# EasyEDA Pro project ProPrj_Hitboard PCB Zero v1.6_2026-01-22 中央 typec.epro

# Board PCB1
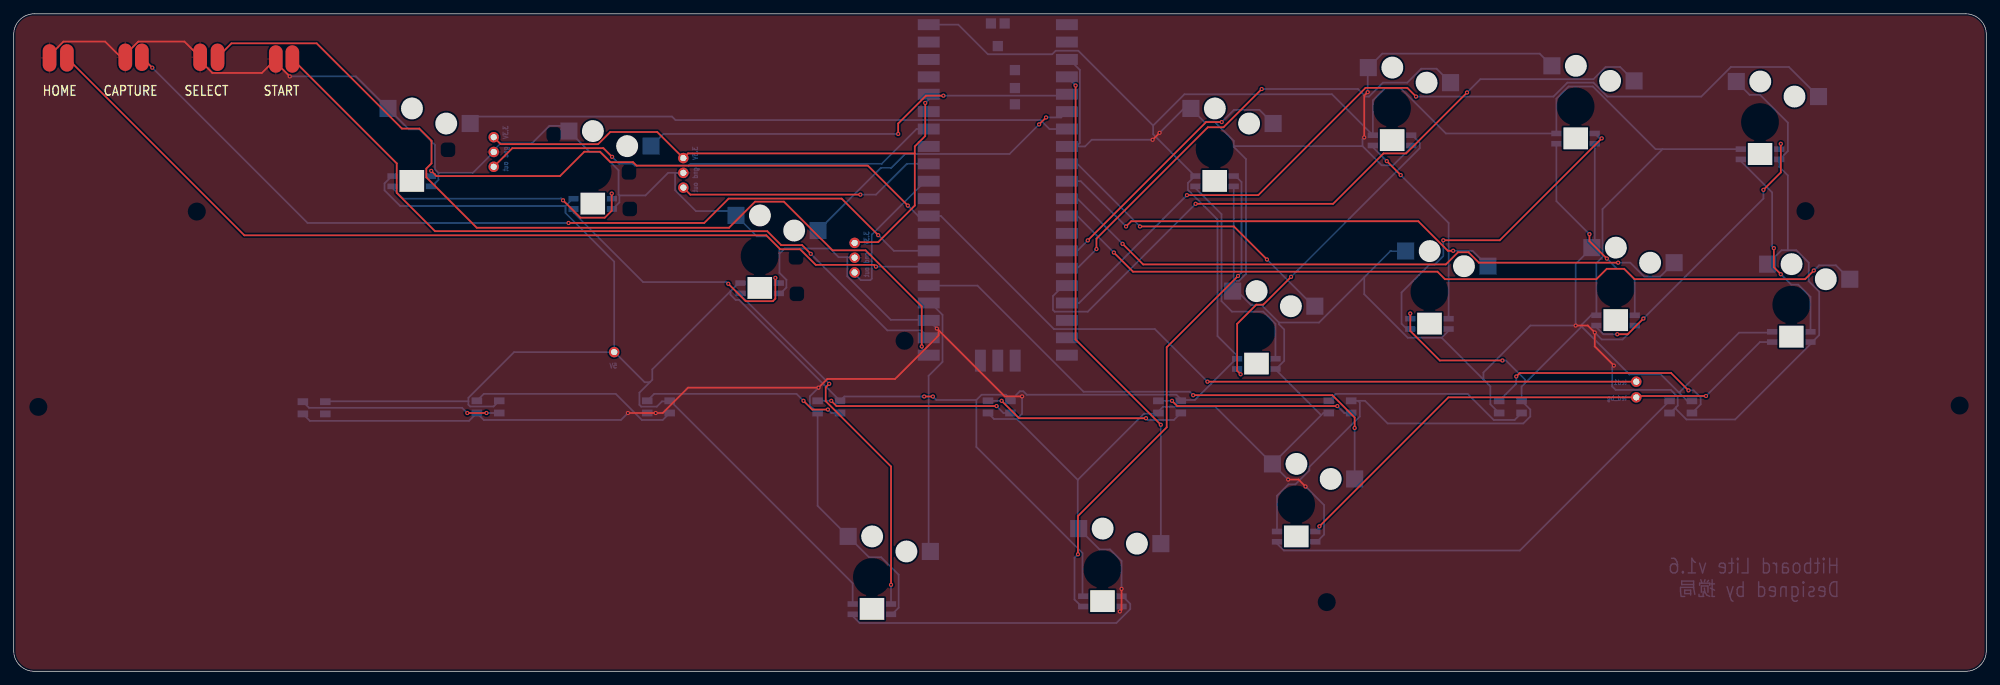
[diagram p0: board, top side]
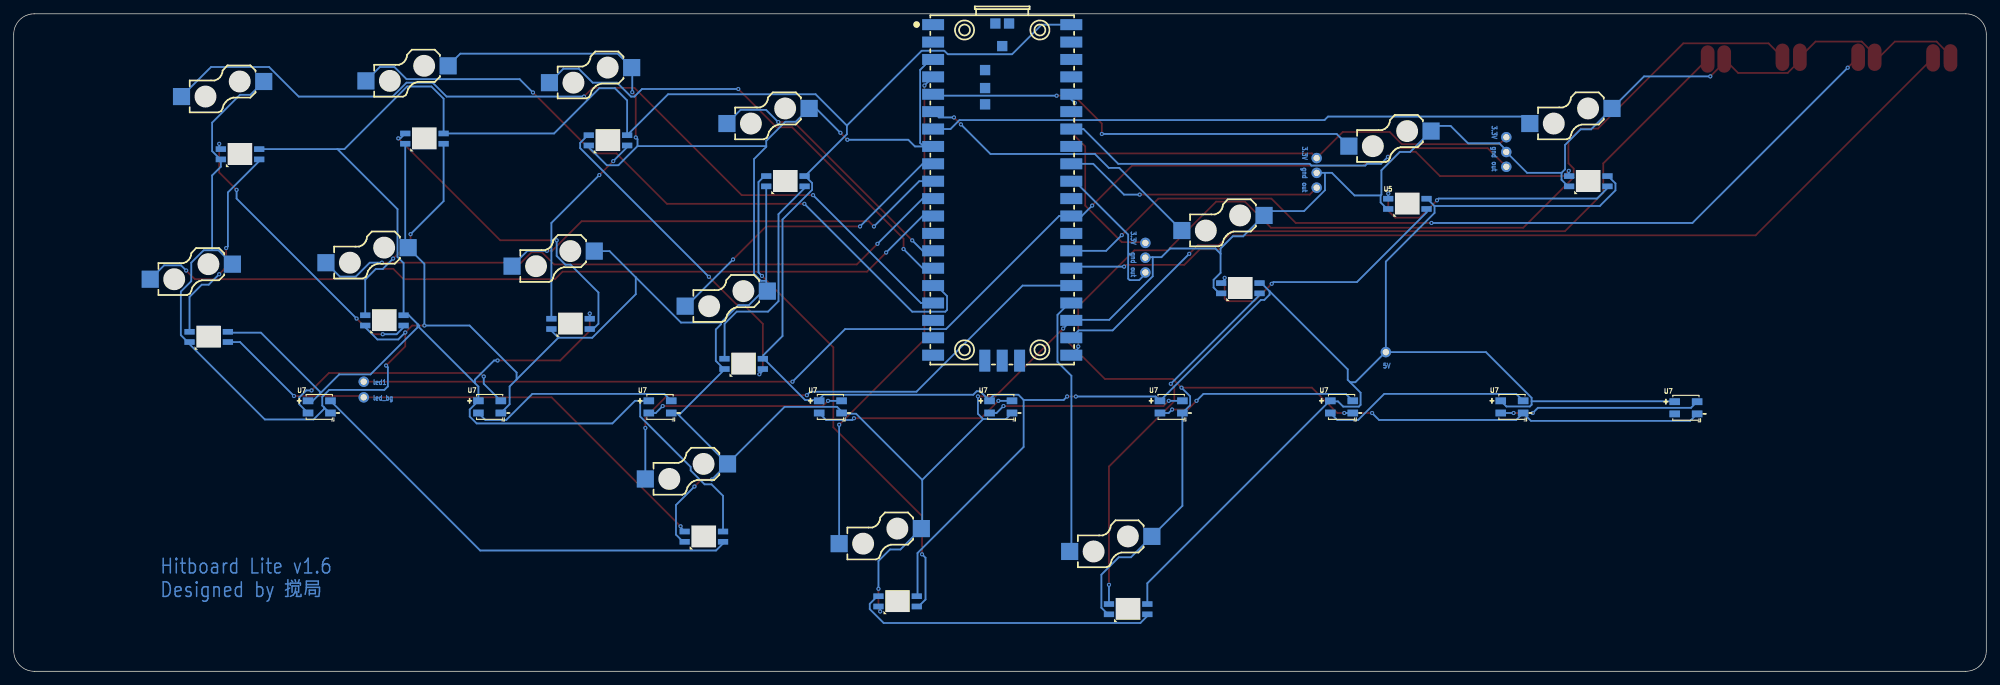
[diagram p1: board, bottom side, seen from below]

Outline 288 x 96 mm; copper layers: Top Layer, Bottom Layer. Coordinates in mm from the lower left corner of the outline.
Outline path: 0,93 arc(0.88,95.12) 3,96 285,96 arc(287.12,95.12) 288,93 288,3 arc(287.12,0.88) 285,0 3,0 arc(0.88,0.88) 0,3 0,93
Stack: Top Layer 0.035mm / Dielectric1 1.51mm FR4 er 4.5 / Bottom Layer 0.035mm

## Design rules (mm)
template: JLCPCB Capability(Two Layers Board)
spacing copperThickness1oz (default): track to track 0.102, other pairs 0.152 to 0.3
spacing copperThickness2oz: track to track 0.203, other pairs 0.152 to 0.3
track width copperThickness1oz (default): min 0.127, default 0.254, max 2.54
track width copperThickness2oz: min 0.203, default 0.254, max 2.54
differential pair differentialPair (default): width min 0.127, default 0.254, max 2.54; gap min 0.152, default 0.152
via viaSize (default): diameter min 0.5, default 0.61, max 10; hole min 0.3, default 0.305, max 6.3

## Placement (name value [footprint] x y rotation side)
NOREF  -  [Pad_e675]  5.23 89.56 0 top
NOREF#2  -  [Pad_e10656]  122.78 62.55 90 top
NOREF#3  -  [Pad_e677]  16.3 89.66 0 top
NOREF#4  -  [Pad_e10672]  70.08 73.66 90 top
NOREF#5  -  [Pad_e10654]  87.67 46.6 0 top
NOREF#6  -  [Pad_e10671]  70.08 75.82 90 top
NOREF#7  -  [Pad_e10657]  122.78 60.39 90 top
NOREF#8  -  [Pad_e681]  38.27 89.4 0 top
NOREF#9  -  [Pad_e678]  18.71 89.66 0 top
NOREF#10  -  [Pad_e679]  27.22 89.66 0 top
NOREF#11  -  [Pad_e676]  7.77 89.56 0 top
NOREF#12  -  [Pad_e10665]  97.77 72.78 90 top
NOREF#13  -  [Pad_e10670]  70.08 77.98 90 top
NOREF#14  -  [Pad_e680]  29.76 89.66 0 top
NOREF#15  -  [Pad_e10658]  122.78 58.23 90 top
NOREF#16  -  [Pad_e682]  40.68 89.4 0 top
NOREF#17  -  [Pad_e10664]  97.77 74.93 90 top
NOREF#18  -  [Pad_e5255]  236.9 40 0 top
NOREF#19  -  [Pad_e10666]  97.77 70.62 90 top
NOREF#20  -  [Pad_e434]  236.9 42.29 0 top
U1  PICO  [COMM-SMD_L51.0-W21.0-P2.54_SC0916]  143.68 69.97 270 bottom
U5  -  [LED-SMD_L3.2-W2.8_YO-WS2812B-3528]  187.24 19.66 180 bottom
U5#2  -  [LED-SMD_L3.2-W2.8_YO-WS2812B-3528]  58.11 71.56 180 bottom
U5#3  -  [LED-SMD_L3.2-W2.8_YO-WS2812B-3528]  84.52 68.25 180 bottom
U5#4  -  [LED-SMD_L3.2-W2.8_YO-WS2812B-3528]  108.91 55.93 180 bottom
U5#5  -  [LED-SMD_L3.2-W2.8_YO-WS2812B-3528]  125.29 9.07 180 bottom
U5#6  -  [LED-SMD_L3.2-W2.8_YO-WS2812B-3528]  158.95 10.21 180 bottom
U5#7  -  [LED-SMD_L3.2-W2.8_YO-WS2812B-3528]  175.33 71.56 180 bottom
U5#8  -  [LED-SMD_L3.2-W2.8_YO-WS2812B-3528]  181.43 44.89 180 bottom
U5#9  -  [LED-SMD_L3.2-W2.8_YO-WS2812B-3528]  201.24 77.52 180 bottom
U5#10  -  [LED-SMD_L3.2-W2.8_YO-WS2812B-3528]  206.7 50.73 180 bottom
U5#11  -  [LED-SMD_L3.2-W2.8_YO-WS2812B-3528]  228.03 77.78 180 bottom
U5#12  -  [LED-SMD_L3.2-W2.8_YO-WS2812B-3528]  233.88 51.24 180 bottom
U5#13  -  [LED-SMD_L3.2-W2.8_YO-WS2812B-3528]  254.96 75.49 180 bottom
U5#14  -  [LED-SMD_L3.2-W2.8_YO-WS2812B-3528]  259.53 48.82 180 bottom
U6  -  [CONN-SMD_HOTPLUGPAKAGE__C9900010116-1]  203.78 87.05 180 bottom
U6#2  -  [CONN-SMD_HOTPLUGPAKAGE__C9900010116-1]  189.78 29.18 180 bottom
U6#3  -  [CONN-SMD_HOTPLUGPAKAGE__C9900010116-1]  60.65 81.08 180 bottom
U6#4  -  [CONN-SMD_HOTPLUGPAKAGE__C9900010116-1]  87.06 77.78 180 bottom
U6#5  -  [CONN-SMD_HOTPLUGPAKAGE__C9900010116-1]  111.45 65.46 180 bottom
U6#6  -  [CONN-SMD_HOTPLUGPAKAGE__C9900010116-1]  127.83 18.6 180 bottom
U6#7  -  [CONN-SMD_HOTPLUGPAKAGE__C9900010116-1]  161.49 19.74 180 bottom
U6#8  -  [CONN-SMD_HOTPLUGPAKAGE__C9900010116-1]  177.87 81.08 180 bottom
U6#9  -  [CONN-SMD_HOTPLUGPAKAGE__C9900010116-1]  183.97 54.41 180 bottom
U6#10  -  [CONN-SMD_HOTPLUGPAKAGE__C9900010116-1]  209.24 60.25 180 bottom
U6#11  -  [CONN-SMD_HOTPLUGPAKAGE__C9900010116-1]  230.57 87.3 180 bottom
U6#12  -  [CONN-SMD_HOTPLUGPAKAGE__C9900010116-1]  236.42 60.76 180 bottom
U6#13  -  [CONN-SMD_HOTPLUGPAKAGE__C9900010116-1]  257.5 85.02 180 bottom
U6#14  -  [CONN-SMD_HOTPLUGPAKAGE__C9900010116-1]  262.07 58.35 180 bottom
U7  -  [LED-SMD_4P-L3.5-W3.5-TL_WS2812B]  43.86 38.48 180 bottom
U7#2  -  [LED-SMD_4P-L3.5-W3.5-TL_WS2812B]  243.39 38.6 180 bottom
U7#3  -  [LED-SMD_4P-L3.5-W3.5-TL_WS2812B]  218.51 38.6 180 bottom
U7#4  -  [LED-SMD_4P-L3.5-W3.5-TL_WS2812B]  193.64 38.6 180 bottom
U7#5  -  [LED-SMD_4P-L3.5-W3.5-TL_WS2812B]  168.76 38.6 180 bottom
U7#6  -  [LED-SMD_4P-L3.5-W3.5-TL_WS2812B]  143.88 38.6 180 bottom
U7#7  -  [LED-SMD_4P-L3.5-W3.5-TL_WS2812B]  119.01 38.6 180 bottom
U7#8  -  [LED-SMD_4P-L3.5-W3.5-TL_WS2812B]  94.13 38.6 180 bottom
U7#9  -  [LED-SMD_4P-L3.5-W3.5-TL_WS2812B]  69.26 38.6 180 bottom

## Footprints (pads in the part's own frame, mm; a bottom-side part is the same pattern mirrored in y, then rotated)
COMM-SMD_L51.0-W21.0-P2.54_SC0916
  rect 1.6x3.2 smd: 1(-24.445,-10.088) 2(-21.905,-10.088) 3(-19.365,-10.088) 4(-16.825,-10.088) 5(-14.285,-10.088) 6(-11.745,-10.088) 7(-9.205,-10.088) 8(-6.665,-10.088) 9(-4.125,-10.088) 10(-1.585,-10.088) 11(0.955,-10.088) 12(3.495,-10.088) 13(6.035,-10.088) 14(8.575,-10.088) 15(11.115,-10.088) 16(13.655,-10.088) 17(16.195,-10.088) 18(18.735,-10.088) 19(21.275,-10.088) 20(23.815,-10.088) 21(23.815,10.088) 22(21.275,10.088) 23(18.735,10.088) 24(16.195,10.088) 25(13.655,10.088) 26(11.115,10.088) 27(8.575,10.088) 28(6.035,10.088) 29(3.495,10.088) 30(0.955,10.088) 31(-1.585,10.088) 32(-4.125,10.088) 33(-6.665,10.088) 34(-9.205,10.088) 35(-11.745,10.088) 36(-14.285,10.088) 37(-16.825,10.088) 38(-19.365,10.088) 39(-21.905,10.088) 40(-24.445,10.088)
  rect 3.2x1.6 smd: 41(24.615,-2.54) 42(24.615,0) 43(24.615,2.54)
  rect 1.5x1.5 smd: TP1(-21.315,0) TP2(-24.615,1) TP3(-24.615,-1) TP4(-17.815,-2.5) TP5(-15.188,-2.5) TP6(-12.815,-2.5)
CONN-SMD_HOTPLUGPAKAGE__C9900010116-1
  rect 2.5x2.5 smd: 1(-6,-1.1) 2(6,1.1)
LED-SMD_4P-L3.5-W3.5-TL_WS2812B
  rect 1.545x0.997 smd: 1(-1.637,0.89) 2(-1.637,-0.89) 3(1.637,-0.89) 4(1.637,0.89)
LED-SMD_L3.2-W2.8_YO-WS2812B-3528
  rect 1.5x0.82 smd: 1(2.8,0.75) 2(2.8,-0.75) 3(-2.8,-0.75) 4(-2.8,0.75)
Pad_e434
  round 1.524 hole 0.914: 1(0,0)
Pad_e675
  oval 2x4 smd: 1(0,0)
Pad_e676
  oval 2x4 smd: 1(0,0)
Pad_e677
  oval 2x4 smd: 1(0,0)
Pad_e678
  oval 2x4 smd: 1(0,0)
Pad_e679
  oval 2x4 smd: 1(0,0)
Pad_e680
  oval 2x4 smd: 1(0,0)
Pad_e681
  oval 2x4 smd: 1(0,0)
Pad_e682
  oval 2x4 smd: 1(0,0)
Pad_e5255
  round 1.524 hole 0.914: 1(0,0)
Pad_e10654
  round 1.524 hole 0.914: 1(0,0)
Pad_e10656
  round 1.524 hole 0.914: 1(0,0)
Pad_e10657
  round 1.524 hole 0.914: 1(0,0)
Pad_e10658
  round 1.524 hole 0.914: 1(0,0)
Pad_e10664
  round 1.524 hole 0.914: 1(0,0)
Pad_e10665
  round 1.524 hole 0.914: 1(0,0)
Pad_e10666
  round 1.524 hole 0.914: 1(0,0)
Pad_e10670
  round 1.524 hole 0.914: 1(0,0)
Pad_e10671
  round 1.524 hole 0.914: 1(0,0)
Pad_e10672
  round 1.524 hole 0.914: 1(0,0)

## Nets
3V3: NOREF#2.1 NOREF#13.1 NOREF#17.1 U1.36
GND: NOREF.1 NOREF#3.1 NOREF#6.1 NOREF#7.1 NOREF#8.1 NOREF#10.1 NOREF#12.1 U1.3 U1.8 U1.23 U5.3 U5#2.3 U5#3.3 U5#4.3 U5#5.3 U5#6.3 U5#7.3 U5#8.3 U5#9.3 U5#10.3 U5#11.3 U5#12.3 U5#13.3 U5#14.3 U6.2 U6#2.2 U6#3.2 U6#4.2 U6#5.2 U6#6.2 U6#7.2 U6#8.2 U6#9.2 U6#10.2 U6#11.2 U6#12.2 U6#13.2 U6#14.2 U7.3 U7#2.3 U7#3.3 U7#4.3 U7#5.3 U7#6.3 U7#7.3 U7#8.3 U7#9.3
VCC: NOREF#5.1 U1.40 U5.1 U5#2.1 U5#3.1 U5#4.1 U5#5.1 U5#6.1 U5#7.1 U5#8.1 U5#9.1 U5#10.1 U5#11.1 U5#12.1 U5#13.1 U5#14.1 U7.1 U7#2.1 U7#3.1 U7#4.1 U7#5.1 U7#6.1 U7#7.1 U7#8.1 U7#9.1
2: U5#2.2 U5#3.4
3: U5#3.2 U5#4.4
4: U5#4.2 U5#5.4
5: U5#5.2 U5#6.4
6: U5#6.2 U5#7.4
7: U5#7.2 U5#8.4
8: U5#8.2 U5#9.4
9: U5#9.2 U5#10.4
10: U5#10.2 U5#11.4
11: U5#11.2 U5#12.4
12: U5#12.2 U5#13.4
13: U5#13.2 U5#14.4
14: NOREF#18.1 U5.4 U5#14.2
15: U5.2 U7#2.4
16: U7#2.2 U7#3.4
17: U7#3.2 U7#4.4
18: U7#4.2 U7#5.4
19: U7#5.2 U7#6.4
20: U7#6.2 U7#7.4
21: U7#7.2 U7#8.4
22: U7#8.2 U7#9.4
23: U7.4 U7#9.2
24: U7.2
A: U1.9 U6#9.1
B: U1.10 U6#10.1
CAPTURE: NOREF#9.1 U1.27
CIZHOU01: NOREF#4.1 U1.34
CIZHOU02: NOREF#19.1 U1.32
CIZHOU03: NOREF#15.1 U1.31
DOWN: U1.5 U6#4.1
HOME: NOREF#11.1 U1.26
L3: U1.24 U6#6.1
LB: U1.17 U6#13.1
LED1: NOREF#20.1 U1.29 U5#2.4
LEFT: U1.7 U6#3.1
LT: U1.12 U6#14.1
R3: U1.25 U6#2.1
RB: U1.16 U6#11.1
RIGHT: U1.6 U6#5.1
RT: U1.11 U6#12.1
SELECT: NOREF#14.1 U1.21
START: NOREF#16.1 U1.22
UP: U1.4 U6#7.1
X: U1.14 U6#8.1
Y: U1.15 U6.1

Pads without a net: U1 1 2 13 18 19 20 28 30 33 35 37 38 39 41 42 43 TP1 TP2 TP3 TP4 TP5 TP6

## Via types
v1: diameter 0.61, hole 0.305, Top Layer to Bottom Layer, 93 vias

## Routing (per net, layer and track width the routed paths; a pad name or vN(x,y) marks a point on that pad's centre or on a via; arc(x,y) is an arc through that point)
3V3: length 92.6
  Top Layer w0.254: 131.56,75.62 98.45,75.62 NOREF#17.1 93.96,78.74 87.1,78.74 85.32,76.97 71.1,76.97 NOREF#13.1 ; 131.56,75.62 131.56,68 126.22,62.67 122.89,62.67 NOREF#2.1 ; 131.56,75.62 131.56,76.64 133.08,78.16 v1(133.08,82.99)
  Bottom Layer w0.254: U1.36 133.59,83.49 v1(133.08,82.99)
GND: length 833.9
  Top Layer w0.254: 16.15,89.66 16.15,89.91 18.19,91.94 24.93,91.94 NOREF#10.1 27.22,89.15 29,87.37 36.24,87.37 NOREF#8.1 38.27,88.89 v1(40.3,86.86) ; 16.15,89.66 15.64,89.66 13.36,91.94 7.26,91.94 5.23,89.91 NOREF.1 ; 16.15,89.66 NOREF#3.1 ; v1(89.68,37.71) v1(93.74,37.71) 94.76,37.71 98.46,41.41 v1(117.51,41.41) 118.78,42.68 128.68,42.68 135.03,49.03 135.03,49.8 ; 135.03,49.8 v1(134.78,50.05) ; 135.03,49.8 144.68,40.14 v1(147.22,40.14) ; v1(233.63,44.64) 230.83,47.44 v1(230.83,49.47) 229.82,50.49 v1(228.04,50.49) ; v1(188.61,26.98) 187.59,28 v1(186.07,28) ; v1(161.49,8.74) 161.75,8.99 v1(161.75,12.04) ; v1(197.18,77.95) 197.18,84.05 v1(197.69,84.56) ; v1(167.3,78.62) v1(166.28,77.61)
  Bottom Layer w0.254: 62.01,72.78 62.01,71.77 61.05,70.81 U5#2.3 ; 62.01,72.78 61.51,73.29 61.51,76.85 59.22,79.13 57.7,79.13 U6#3.2 49.97,86.86 v1(40.3,86.86) ; 62.01,72.78 67.04,72.78 NOREF#6.1 70.08,76.08 71.1,77.09 75.67,77.09 78.21,79.63 80.31,79.63 U6#4.2 84.11,75.83 85.64,75.83 88.31,73.15 88.31,69.6 88.43,69.48 ; 96.56,72.78 96.56,70.24 99.61,67.19 104.81,67.19 U6#5.2 108.5,63.51 110.02,63.51 111.8,61.73 111.8,60.97 ; 96.56,72.78 95.54,72.78 92.24,69.48 88.43,69.48 ; 96.56,72.78 97.76,72.78 ; U6#11.2 222.8,90.18 199.81,90.18 U6.2 197.69,88.06 v1(197.69,84.56) ; U5#6.3 161.49,9.21 v1(161.49,8.74) ; 155.35,27.95 165,37.6 166.78,37.6 ; 155.35,27.95 146.46,36.84 ; 155.35,27.95 155.35,20.97 U6#7.2 158.53,17.79 160.06,17.79 161.75,16.1 v1(161.75,12.04) ; 208.48,48.71 203.53,48.71 197.18,55.06 197.18,57.52 ; 208.48,48.71 209.5,49.72 U5#10.3 ; 208.48,48.71 214.58,42.61 ; U5#11.3 230.83,62.28 U6#12.2 228.04,59.48 v1(228.04,50.49) 221.44,50.49 214.58,43.63 214.58,42.61 ; U5#9.3 204.04,76.52 201.41,73.89 199.72,73.89 196.93,76.68 ; 259.03,61.48 259.03,72.4 257.76,73.67 257.76,74.69 ; 259.03,61.48 260.26,61.48 262.08,59.66 262.08,56.96 263.6,55.44 263.6,49.09 262.58,48.07 U5#14.3 262.33,47.77 251.33,36.77 244.22,36.77 242.69,38.29 242.69,38.55 ; 259.03,61.48 258.1,61.48 256.07,59.45 ; 183.78,30.28 190.89,37.4 ; 183.78,30.28 175.44,38.62 167.8,38.62 166.78,37.6 ; 183.78,30.28 v1(186.07,28) ; 190.89,37.4 191.21,37.71 U7#4.3 ; 190.89,37.4 184.22,44.06 ; v1(230.83,49.47) 231.85,48.45 234.9,48.45 236.68,50.23 U5#12.3 ; 178.13,76.68 178.13,76.57 179.91,74.8 179.91,58.03 178.89,57.02 178.13,57.02 ; 178.13,76.68 178.13,77.44 175.34,80.24 173.81,80.24 U6#8.2 170.85,82.18 v1(167.3,78.62) ; 178.13,76.68 196.93,76.68 ; U5#3.3 87.47,67.5 88.43,68.46 88.43,69.48 ; 111.8,60.97 112.56,61.73 119.16,61.73 120.43,60.46 121.7,60.46 ; 111.8,60.97 111.8,58.18 112.81,57.16 112.81,56.04 111.96,55.18 U5#4.3 ; 197.18,57.52 190.58,50.92 184.73,50.92 ; 197.18,57.52 201.01,61.35 U6#10.2 ; 178.13,57.02 U5#7.3 ; 178.13,57.02 178.13,55.49 ; U5.3 190.26,18.91 191.31,19.96 191.31,24.28 v1(188.61,26.98) ; 166.78,37.6 167.01,37.6 U7#5.3 ; U7#3.3 215.59,38.99 215.59,41.6 214.58,42.61 ; 242.69,38.55 242.95,38.8 242.95,40.07 241.93,41.09 233.88,41.09 233.37,41.6 233.37,44.39 v1(233.63,44.64) ; 242.69,38.55 241.86,37.71 U7#2.3 ; NOREF#7.1 122.71,60.46 121.7,60.46 ; v1(89.68,37.71) 88.66,36.7 68.64,36.7 U7#9.3 66.48,36.57 43.23,36.57 U7.3 ; U1.3 154.13,89.34 155.66,87.81 155.66,77.14 155.15,76.64 ; U6#9.2 177.98,55.49 178.13,55.49 ; 146.46,36.84 147.22,37.6 v1(147.22,40.14) ; 146.46,36.84 143.12,36.84 U7#6.3 ; 121.7,60.46 121.7,57.67 128.05,51.32 133.51,51.32 v1(134.78,50.05) ; 184.73,50.92 184.73,50.67 185.5,49.9 185.5,45.33 184.22,44.06 ; 184.73,50.92 182.19,53.46 180.67,53.46 178.64,55.49 178.13,55.49 ; 184.22,44.06 U5#8.3 ; v1(166.28,77.61) 157.39,77.61 156.42,76.64 155.15,76.64 ; 257.76,74.69 259.03,75.96 259.03,80.11 254.96,84.18 253.44,84.18 251.5,86.12 ; 257.76,74.69 U5#13.3 ; 155.15,76.64 U1.8 ; 196.93,76.68 196.93,77.7 v1(197.18,77.95) ; v1(93.74,37.71) U7#8.3 ; U5#5.3 128.24,8.32 129.2,9.28 129.2,14.11 126.66,16.65 124.88,16.65 U6#6.2 117.37,24.16 U7#7.3 116.24,38.85 116.24,40.14 v1(117.51,41.41)
VCC: length 655.3
  Top Layer w0.254: v1(203.9,52.24) 203.9,49.7 208.22,45.38 v1(217.36,45.38) ; v1(134.2,40.12) v1(132.93,40.12)
  Bottom Layer w0.254: 104.64,55.49 104.64,54.99 105.41,54.22 105.91,54.22 U7#7.1 121.28,40.12 v1(132.93,40.12) ; 104.64,55.49 93.23,44.08 93.23,42.56 92.88,42.21 ; 104.64,55.49 105.83,56.68 U5#4.1 ; NOREF#5.1 87.72,46.6 92.12,42.21 92.88,42.21 ; NOREF#5.1 73.05,46.6 66.39,39.94 66.39,39.43 ; NOREF#5.1 87.67,59.81 80.56,66.92 80.56,67.94 ; 140.55,39.62 134.71,39.62 v1(134.2,40.12) ; 140.55,39.62 140.55,32.76 156.04,17.26 156.04,11.07 U5#6.1 ; 140.55,39.62 141.31,40.38 144.87,40.38 145.63,39.62 ; 229.04,50.72 230.31,51.99 U5#12.1 231.08,59.61 231.97,60.49 231.97,67.48 240.73,76.24 ; 229.04,50.72 229.04,50.21 235.9,43.35 240.47,43.35 243.27,40.56 ; 229.04,50.72 228.79,50.46 228.79,50.21 220.66,42.08 ; 178.55,45.71 178.55,46.16 175.75,48.95 175.75,65.97 171.44,70.29 171.44,71.3 172.45,72.32 ; 178.55,45.71 172.45,39.62 170.52,39.62 ; 178.55,45.71 U5#8.1 ; 243.27,40.56 243.27,40.81 251.9,49.45 256.6,49.45 U5#14.1 ; 243.27,40.56 244.33,39.49 U7#2.1 ; v1(217.36,45.38) 217.87,45.38 220.66,42.59 220.66,42.08 ; 80.56,67.94 81.62,69 U5#3.1 ; 80.56,67.94 56.43,67.94 54.14,70.23 54.14,71.24 55.21,72.31 U5#2.1 ; 145.63,39.62 146.9,40.89 147.41,40.89 147.92,40.38 169.76,40.38 170.52,39.62 ; 145.63,39.62 U7#6.1 ; 66.39,39.43 45.56,39.43 U7.1 ; 66.39,39.43 66.39,38.92 66.64,38.67 70.07,38.67 U7#9.1 ; 170.52,39.62 U7#5.1 ; 220.66,42.08 220.15,41.57 U7#3.1 221.42,38.22 221.42,37.21 220.41,36.19 200.59,36.19 197.29,39.49 196.28,39.49 ; 196.28,39.49 U7#4.1 ; 196.28,39.49 196.53,39.24 196.53,37.21 189.16,29.84 189.16,29.33 187.13,27.3 186.12,27.3 184.44,25.63 184.44,20.41 ; U1.40 137.91,94.42 142.23,90.1 151.62,90.1 152.13,90.61 155.44,90.61 166.36,79.68 ; 166.36,79.68 166.36,78.41 172.45,72.32 ; 166.36,79.68 170.93,84.26 192.46,84.26 U5#9.1 198.44,83.35 200.22,85.13 202.5,85.13 209.11,78.53 U5#11.1 225.23,83.61 227.01,85.39 230.57,85.39 239.71,76.24 240.73,76.24 ; 95.67,39.41 95.93,39.41 122.49,12.85 U5#5.1 ; 95.67,39.41 94.66,39.41 93.9,38.65 91.61,38.65 91.36,38.9 91.36,40.68 92.88,42.21 ; 95.67,39.41 U7#8.1 ; v1(203.9,52.24) U5#10.1 ; 240.73,76.24 U5#13.1 ; 172.45,72.32 172.52,72.32 U5#7.1
2: length 37.7
  Top Layer w0.254: v1(87.31,69.75) 87.31,67.25 86.3,66.23 82.74,66.23 v1(80.2,68.77)
  Bottom Layer w0.254: U5#3.4 87.31,69.02 v1(87.31,69.75) ; v1(80.2,68.77) 79.95,69.03 56.83,69.03 55.31,70.55 U5#2.2
3: length 39.5
  Top Layer w0.254: v1(104.33,56.58) 106.87,54.04 110.84,54.04 111.2,54.4 v1(111.2,57.45)
  Bottom Layer w0.254: v1(111.2,57.45) 111.2,57.19 U5#4.4 ; v1(104.33,56.58) 104.08,56.84 91.88,56.84 81.72,67 U5#3.2
4: length 54.9
  Top Layer w0.254: v1(119.06,41.98) 118.55,41.47 118.55,39.44 128.09,29.9 v1(128.09,12.63)
  Bottom Layer w0.254: v1(128.09,12.63) U5#5.4 ; v1(119.06,41.98) 106.11,54.93 U5#4.2
5: length 44.5
  Bottom Layer w0.254: U5#6.4 161.97,10.74 162.12,10.74 163.02,9.85 163.02,9.08 160.98,7.05 123.51,7.05 122.49,8.07 U5#5.2
6: length 74.2
  Top Layer w0.254: v1(155.38,17.08) 155.38,22.67 168.34,35.63 168.34,47.31 v1(178.75,57.72)
  Bottom Layer w0.254: v1(178.75,57.72) 179.26,58.23 179.26,71.44 178.4,72.31 U5#7.4 ; v1(155.38,17.08) 154.88,16.58 154.88,10.48 155.89,9.46 U5#6.2
7: length 32.7
  Bottom Layer w0.254: U5#7.2 172.53,70.55 176.34,66.74 176.34,54.04 177.86,52.52 182.44,52.52 184.21,50.74 184.21,45.65 U5#8.4
8: length 48.3
  Top Layer w0.254: v1(186.5,57.6) 182.44,53.53 181.42,53.53 178.62,50.74 178.62,43.88 v1(179.13,43.37)
  Bottom Layer w0.254: U5#9.4 204.18,78.27 205.3,77.16 205.3,76.39 v1(186.5,57.6) ; v1(179.13,43.37) 178.62,43.88 U5#8.2
9: length 29.9
  Top Layer w0.254: v1(200.47,74.49) v1(202.5,72.46)
  Bottom Layer w0.254: v1(200.47,74.49) 198.44,76.52 U5#9.2 ; U5#10.4 209.5,65.46 v1(202.5,72.46)
10: length 47.4
  Top Layer w0.254: v1(208.72,62.93) 216.97,62.93 v1(231.85,77.81)
  Bottom Layer w0.254: U5#11.4 231.55,77.81 v1(231.85,77.81) ; v1(208.72,62.93) 208.72,60.65 207.45,59.38 206.69,59.38 202.63,55.31 202.63,50.74 203.39,49.98 U5#10.2
11: length 30.4
  Top Layer w0.254: v1(230.06,63.82) 230.06,62.8 v1(232.6,60.26)
  Bottom Layer w0.254: U5#11.2 225.23,68.65 v1(230.06,63.82) ; v1(232.6,60.26) 234.12,58.74 235.14,58.74 236.68,57.2 U5#12.4
12: length 43.2
  Top Layer w0.254: v1(255.46,70.3) 258,72.84 v1(258,77.02) ; v1(237.93,51.5) 235.65,49.22 v1(234.12,49.22)
  Bottom Layer w0.254: v1(234.12,49.22) 232.09,49.22 231.08,50.23 U5#12.2 ; v1(255.46,70.3) 255.46,69.03 v1(237.93,51.5) ; v1(258,77.02) 258,76.48 U5#13.4
13: length 30
  Top Layer w0.254: v1(256.98,61.79) 256.98,58.99 v1(258,57.98)
  Bottom Layer w0.254: v1(256.98,61.79) 256.73,62.04 256.73,69.92 252.16,74.49 U5#13.2 ; U5#14.4 262.33,54.66 260.54,56.45 259.52,56.45 v1(258,57.98)
14: length 78.2
  Top Layer w0.254: v1(190.64,21.17) 209.46,40 NOREF#18.1 237.1,40.2 v1(247.08,40.2)
  Bottom Layer w0.254: v1(247.08,40.2) 254.95,48.07 U5#14.2 ; v1(190.64,21.17) 190.64,21 U5.4
15: length 67
  Bottom Layer w0.254: U7#2.4 219.9,17.64 185.46,17.64 184.44,18.65 184.44,18.91
16: length 36
  Top Layer w0.254: v1(244.52,41.01) 241.98,43.55 219.88,43.55 v1(219.37,43.05)
  Bottom Layer w0.254: v1(219.37,43.05) 219.37,41.99 U7#3.4 ; U7#2.2 246.3,38.98 246.3,40 245.28,41.01 v1(244.52,41.01)
17: length 30.6
  Bottom Layer w0.254: U7#4.4 193.01,40.51 212.28,40.51 216.09,36.7 219.13,36.7 U7#3.2
18: length 28.9
  Top Layer w0.254: v1(193.24,38.73) 169.87,38.73 v1(169.11,39.49)
  Bottom Layer w0.254: v1(193.24,38.73) 194.26,37.71 U7#4.2 ; v1(169.11,39.49) 167.13,39.49
19: length 29.7
  Top Layer w0.254: v1(144.24,39.49) 146.78,36.95 v1(165.32,36.95)
  Bottom Layer w0.254: v1(165.32,36.95) 165.57,36.7 169.38,36.7 U7#5.2 ; v1(144.24,39.49) 142.25,39.49
20: length 28.9
  Top Layer w0.254: v1(143.49,38.73) 120.12,38.73 v1(119.36,39.49)
  Bottom Layer w0.254: v1(143.49,38.73) 144.51,37.71 U7#6.2 ; v1(119.36,39.49) 117.37,39.49
21: length 29.7
  Top Layer w0.254: v1(118.87,38.22) 116.58,38.22 v1(115.31,39.49)
  Bottom Layer w0.254: U7#7.2 119.38,37.71 v1(118.87,38.22) ; v1(115.31,39.49) 114.3,40.51 93.51,40.51 U7#8.4
22: length 30.6
  Bottom Layer w0.254: U7#8.2 94.75,36.7 91.71,36.7 87.9,40.51 68.63,40.51 U7#9.4
23: length 29.4
  Top Layer w0.254: v1(66.22,37.71) v1(69.02,37.71)
  Bottom Layer w0.254: v1(69.02,37.71) U7#9.2 ; v1(66.22,37.71) 65.46,38.47 43.11,38.47 U7.4
A: length 44.8
  Top Layer w0.254: v1(182.98,60.13) 178.15,64.95 v1(164.43,64.95)
  Bottom Layer w0.254: U6#9.1 189.79,53.31 v1(182.98,60.13) ; U1.9 155.29,74.1 v1(164.43,64.95)
B: length 67.2
  Top Layer w0.254: v1(162.4,64.95) 163.16,65.71 205.07,65.71 209.39,61.4 v1(210.15,61.4)
  Bottom Layer w0.254: U6#10.1 212.99,61.4 v1(210.15,61.4) ; v1(162.4,64.95) 155.8,71.56 U1.10
CAPTURE: length 129.5
  Top Layer w0.254: NOREF#9.1 v1(20.23,88.13) ; v1(126.22,63.68) 120.88,69.02 104.37,69.02 100.82,65.46 v1(81.01,65.46)
  Bottom Layer w0.254: v1(126.22,63.68) 128.5,61.4 U1.27 ; v1(81.01,65.46) 42.91,65.46 v1(20.23,88.13)
CIZHOU01: length 67.9
  Top Layer w0.254: NOREF#4.1 72.8,76.38 86.09,76.38 v1(87.36,75.11)
  Bottom Layer w0.254: U1.34 131.81,79.18 126.73,74.1 98.79,74.1 98.54,73.84 90.67,73.84 90.41,74.1 88.38,74.1 v1(87.36,75.11)
CIZHOU02: length 38.1
  Top Layer w0.254: NOREF#19.1 98.78,69.6 v1(123.61,69.6)
  Bottom Layer w0.254: U1.32 130.39,74.1 125.9,69.6 v1(123.61,69.6)
CIZHOU03: length 21.2
  Bottom Layer w0.254: NOREF#15.1 122.92,58.09 122.92,57.87 123.69,57.11 125.06,57.11 125.28,57.33 125.28,63.76 133.08,71.56 U1.31
DOWN: length 64.7
  Top Layer w0.254: v1(135.74,84.04) 133.2,84.04 129.13,79.98 v1(129.13,78.46)
  Bottom Layer w0.254: v1(135.74,84.04) 153.55,84.04 U1.5 ; U6#4.1 94.84,78.46 v1(129.13,78.46)
HOME: length 138.5
  Top Layer w0.254: v1(125.88,59.08) 125.63,59.34 117.1,59.34 114.81,61.62 111.91,61.62 109.88,63.66 33.68,63.66 NOREF#11.1
  Bottom Layer w0.254: U1.26 133.36,59.08 v1(125.88,59.08)
L3: length 38.2
  Bottom Layer w0.254: U1.24 133.87,53.78 135.61,52.04 135.61,45.18 133.58,43.15 133.58,17.75 U6#6.1
LB: length 128.5
  Top Layer w0.254: v1(171.29,69.52) 181.71,69.52 197.37,85.19 203.46,85.19 v1(204.73,83.92)
  Bottom Layer w0.254: U6#13.1 259.18,88.24 250.71,88.24 246.39,83.92 232.67,83.92 230.64,85.95 226.83,85.95 224.8,83.92 v1(204.73,83.92) ; v1(171.29,69.52) 155.54,53.78 U1.17
LED1: length 192.4
  Top Layer w0.254: v1(60.96,73.07) 61.72,72.31 79.76,72.31 83.31,75.86 85.6,75.86 87.12,74.34 90.42,74.34 90.93,73.83 124.71,73.83 v1(130.54,68) ; v1(174.29,42.29) NOREF#20.1
  Bottom Layer w0.254: v1(60.96,73.07) 60.96,72.36 U5#2.4 ; v1(130.54,68) 132.07,66.48 U1.29 135.37,66.48 151.88,49.97 166.61,49.97 v1(174.29,42.29)
LEFT: length 88.3
  Bottom Layer w0.254: U1.7 151.23,79.18 149.91,80.49 96.62,80.49 96.11,81 67.66,81 U6#3.1
LT: length 121.1
  Top Layer w0.254: v1(160.62,61.14) 163.42,58.35 207.87,58.35 208.97,57.25 231.07,57.25 232.59,58.77 235.13,58.77 236.66,57.25 261.55,57.25 v1(262.82,58.52)
  Bottom Layer w0.254: U6#14.1 266.04,59.28 263.58,59.28 v1(262.82,58.52) ; v1(160.62,61.14) 155.29,66.48 U1.12
R3: length 79.1
  Top Layer w0.254: v1(195.78,35.53) 195.78,37.05 192.52,40.31 v1(172.2,40.31)
  Bottom Layer w0.254: v1(172.2,40.31) 171.69,40.82 156.2,40.82 140.7,56.32 U1.25 ; v1(195.78,35.53) U6#2.1
RB: length 105.3
  Top Layer w0.254: v1(172.56,68.25) 192.63,68.25 199.99,75.62 203.3,75.62 v1(212.19,84.51)
  Bottom Layer w0.254: U1.16 153.26,56.32 151.73,54.79 151.73,52.76 151.99,52.51 156.81,52.51 v1(172.56,68.25) ; U6#11.1 234.54,88.24 232.42,88.24 230.64,86.46 214.13,86.46 v1(212.19,84.51)
RIGHT: length 43.5
  Top Layer w0.254: v1(149.71,79.85) v1(150.72,80.87)
  Bottom Layer w0.254: v1(149.71,79.85) 145.39,75.54 130.15,75.54 128.12,73.5 126.59,73.5 U6#5.1 ; U1.6 152.92,80.87 v1(150.72,80.87)
RT: length 95.7
  Top Layer w0.254: v1(161.89,62.41) 164.9,59.41 209.1,59.41 210.87,61.18 212.4,61.18 213.92,59.66 v1(234.24,59.66)
  Bottom Layer w0.254: U1.11 155.29,69.02 v1(161.89,62.41) ; U6#12.1 240.38,57.63 238.05,57.63 236.02,59.66 v1(234.24,59.66)
SELECT: length 134.5
  Top Layer w0.254: NOREF#14.1 31.79,91.69 44.24,91.69 56.68,79.24 59.22,79.24 61,77.46 61,74.16 60.24,73.4 60.24,72.13 67.61,64.76 104.44,64.76 108.25,68.57 112.44,68.57 119.56,61.46 124.38,61.46 132.58,53.27 v1(132.58,47.43)
  Bottom Layer w0.254: U1.21 132.58,47.17 v1(132.58,47.43)
START: length 112.3
  Top Layer w0.254: NOREF#16.1 55.92,74.16 55.92,69.84 61.51,64.26 110.02,64.26 112.06,62.22 115.1,62.22 v1(116.37,60.95)
  Bottom Layer w0.254: U1.22 132.51,49.78 127.55,49.78 v1(116.37,60.95)
UP: length 73.8
  Top Layer w0.254: v1(167.48,36) 155.04,48.44 v1(155.04,85.53)
  Bottom Layer w0.254: v1(167.48,36) 167.48,18.64 ; U1.4 v1(155.04,85.53)
X: length 39.4
  Top Layer w0.254: v1(156.81,62.92) 174.09,80.19 v1(176.37,80.19)
  Bottom Layer w0.254: v1(176.37,80.19) 178.15,81.97 181.88,81.97 U6#8.1 ; U1.14 155.29,61.4 v1(156.81,62.92)
Y: length 70.7
  Top Layer w0.254: v1(182.21,85.02) 176.63,79.43 174.34,79.43 158.08,63.17 v1(158.08,61.65)
  Bottom Layer w0.254: v1(182.21,85.02) 196.27,85.02 197.37,83.92 197.88,83.92 199.91,85.95 203.46,85.95 205.5,87.98 207.75,87.98 U6.1 ; U1.15 155.29,58.86 v1(158.08,61.65)

## Copper pours and planes (outline as drawn; the poured copper is in the pictures)
GND on Top Layer: -2.37,106.42 296.21,106.42 296.21,-11.31 -2.37,-11.31

## Text on the board
Bottom Layer: 5V | led1 | led_bg | out | 3.3V | gnd | Hitboard Lite v1.6 / Designed by 搅局
Top Silkscreen Layer: HOME | CAPTURE | SELECT | START
